# Altium schematic sheet LCD_Button_LED.SchDoc
size A4
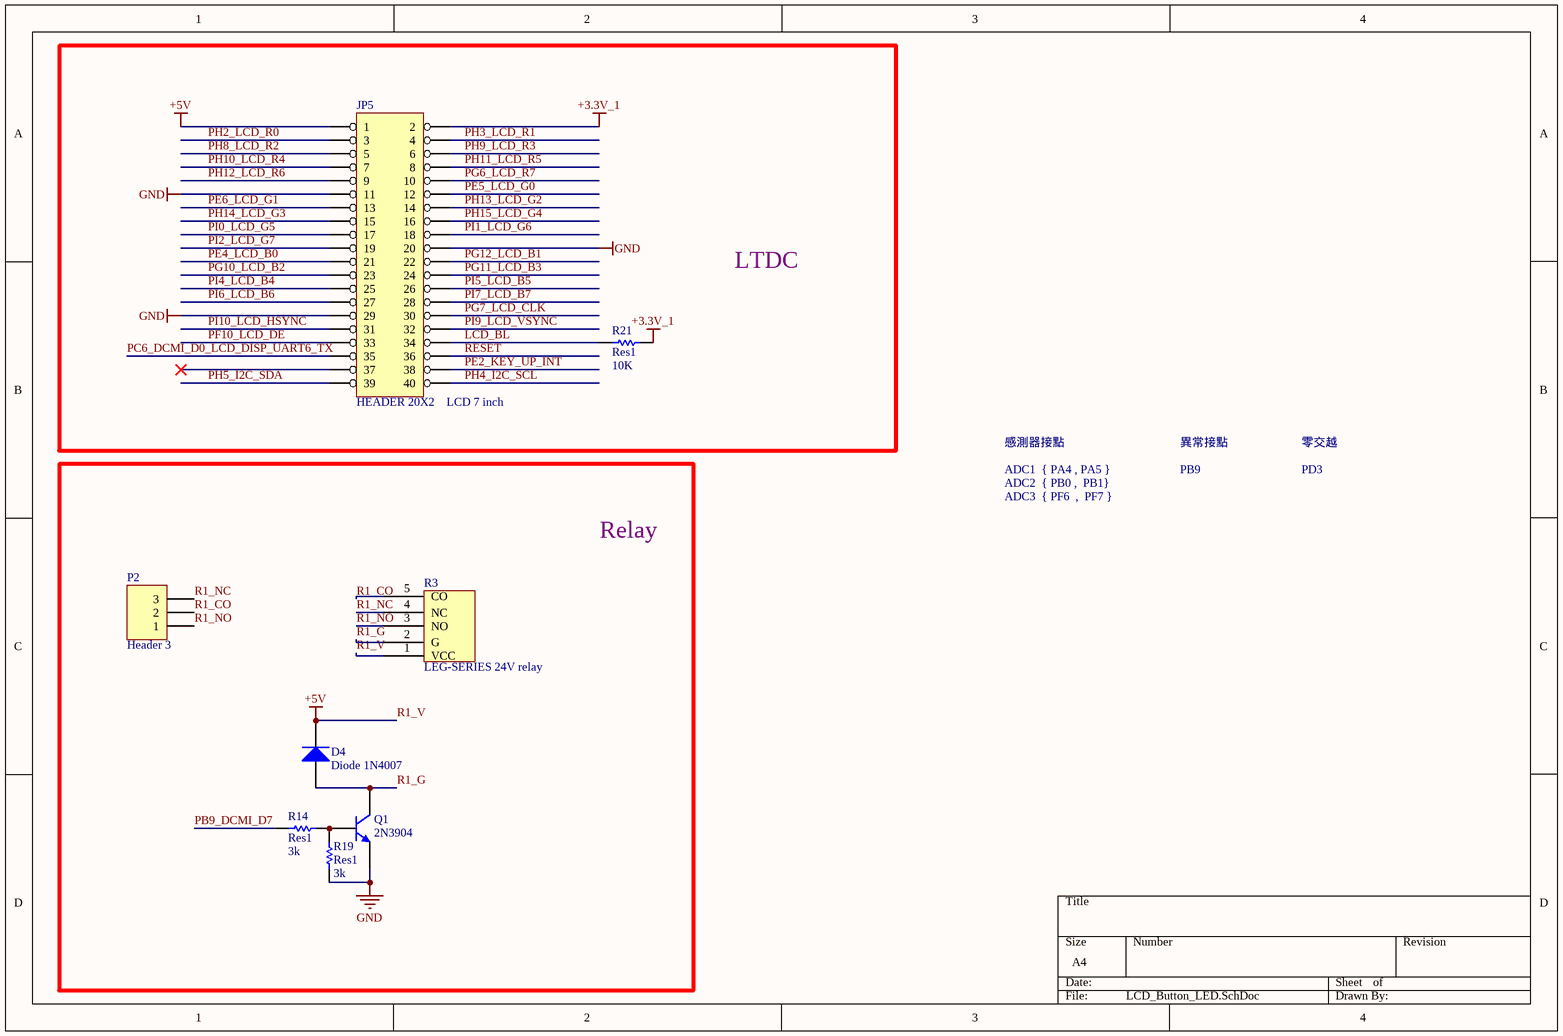
[diagram p0: LCD_Button_LED.SchDoc]

## Parts
D4  Diode 1N4007  [DO-41]
JP5  HEADER 20X2    LCD 7 inch  [HDR2X20]
P2  Header 3  [歐式端子*3p]
Q1  2N3904  [TO-92A]
R3  LEG-SERIES 24V relay  [LEG-SERIES 5V]
R14  Res1  value 3k  [0805_C]
R19  Res1  value 3k  [0805_C]
R21  Res1  value 10K  [0805_C]

## Blocks framed on the sheet
LTDC: JP5 R21
Relay: D4 P2 Q1 R3 R14 R19

## Nets
+3.3V_1: JP5.2 R21.1
GND: JP5.11 JP5.20 JP5.29 Q1.1(E) R19.1
R1_V: D4.2(K) JP5.1 R3.1(VCC)  [also labelled +5V]
LCD_BL: JP5.34 R21.2
PB9_DCMI_D7: R14.1
PC6_DCMI_D0_LCD_DISP_UART6_TX: JP5.35
PE2_KEY_UP_INT: JP5.38
PE4_LCD_B0: JP5.21
PE5_LCD_G0: JP5.12
PE6_LCD_G1: JP5.13
PF10_LCD_DE: JP5.33
PG6_LCD_R7: JP5.10
PG7_LCD_CLK: JP5.30
PG10_LCD_B2: JP5.23
PG11_LCD_B3: JP5.24
PG12_LCD_B1: JP5.22
PH2_LCD_R0: JP5.3
PH3_LCD_R1: JP5.4
PH4_I2C_SCL: JP5.40
PH5_I2C_SDA: JP5.39
PH8_LCD_R2: JP5.5
PH9_LCD_R3: JP5.6
PH10_LCD_R4: JP5.7
PH11_LCD_R5: JP5.8
PH12_LCD_R6: JP5.9
PH13_LCD_G2: JP5.14
PH14_LCD_G3: JP5.15
PH15_LCD_G4: JP5.16
PI0_LCD_G5: JP5.17
PI1_LCD_G6: JP5.18
PI2_LCD_G7: JP5.19
PI4_LCD_B4: JP5.25
PI5_LCD_B5: JP5.26
PI6_LCD_B6: JP5.27
PI7_LCD_B7: JP5.28
PI9_LCD_VSYNC: JP5.32
PI10_LCD_HSYNC: JP5.31
R1_CO: P2.2 R3.5(CO)
R1_G: D4.1(A) Q1.3(C) R3.2(G)
R1_NC: P2.3 R3.4(NC)
R1_NO: P2.1 R3.3(NO)
RESET: JP5.36
NetQ1_2: Q1.2(B) R14.2 R19.2

Not connected (* = marked no-connect by the designer): JP5 37*

## Notes on the sheet
- 感測器接點
- 異常接點
- 零交越
- ADC1  { PA4 , PA5 }
- ADC3  { PF6  ,  PF7 }
- ADC2  { PB0 ,  PB1}
- PB9
- PD3

## Library data of the parts
D4 = Diode 1N914: High Conductance Fast Diode; Published: 8-Jun-2000; LatestRevisionDate: 17-Jul-2002; LatestRevisionNote: Re-released for DXP Platform.; DatasheetVersion: 1997; PackageReference: DO-35; Publisher: Altium Limited; Code_JEDEC: DO-204-AH; ComponentLink1Description: Manufacturer Link; ComponentLink1URL: http://www.fairchildsemi.com/; ComponentLink2Description: Datasheet; ComponentLink2URL: http://www.fairchildsemi.com/ds/1N%2F1N4448.pdf
JP5 = HEADER 20X2
P2 = Header 3: Header, 3-Pin; LatestRevisionDate: 17-Jul-2002; LatestRevisionNote: Re-released for DXP Platform.; Publisher: Altium Limited
Q1 = 2N3904: NPN General Purpose Amplifier; Published: 8-Jun-2000; LatestRevisionDate: 15-Jan-2003; LatestRevisionNote: PCB Footprint 'BCY-W3/D4.7' replaced; DatasheetVersion: 1997; PackageVersion: Sep-1998; PackageReference: TO-92A; Publisher: Altium Limited; Code_JEDEC: TO-92A; ComponentLink1Description: Manufacturer Link; ComponentLink1URL: http://www.fairchildsemi.com/; ComponentLink2Description: Datasheet; ComponentLink2URL: http://www.fairchildsemi.com/ds/2N%2F2N3904.pdf
R3 = LEG-SERIES 5V relay
R14 R19 R21 = Res1: Resistor; Published: 8-Jun-2000; LatestRevisionDate: 17-Jul-2002; LatestRevisionNote: Re-released for DXP Platform.; PackageReference: AXIAL-0.3; Publisher: Altium Limited
  R21: PackageDescription: Axial Device, Thru-Hole; 2 Leads; 0.3 in Pin Spacing